# Altium schematic sheet PWR_MGMT.SchDoc
size A4; SheetNumber: 3; SheetTotal: 3
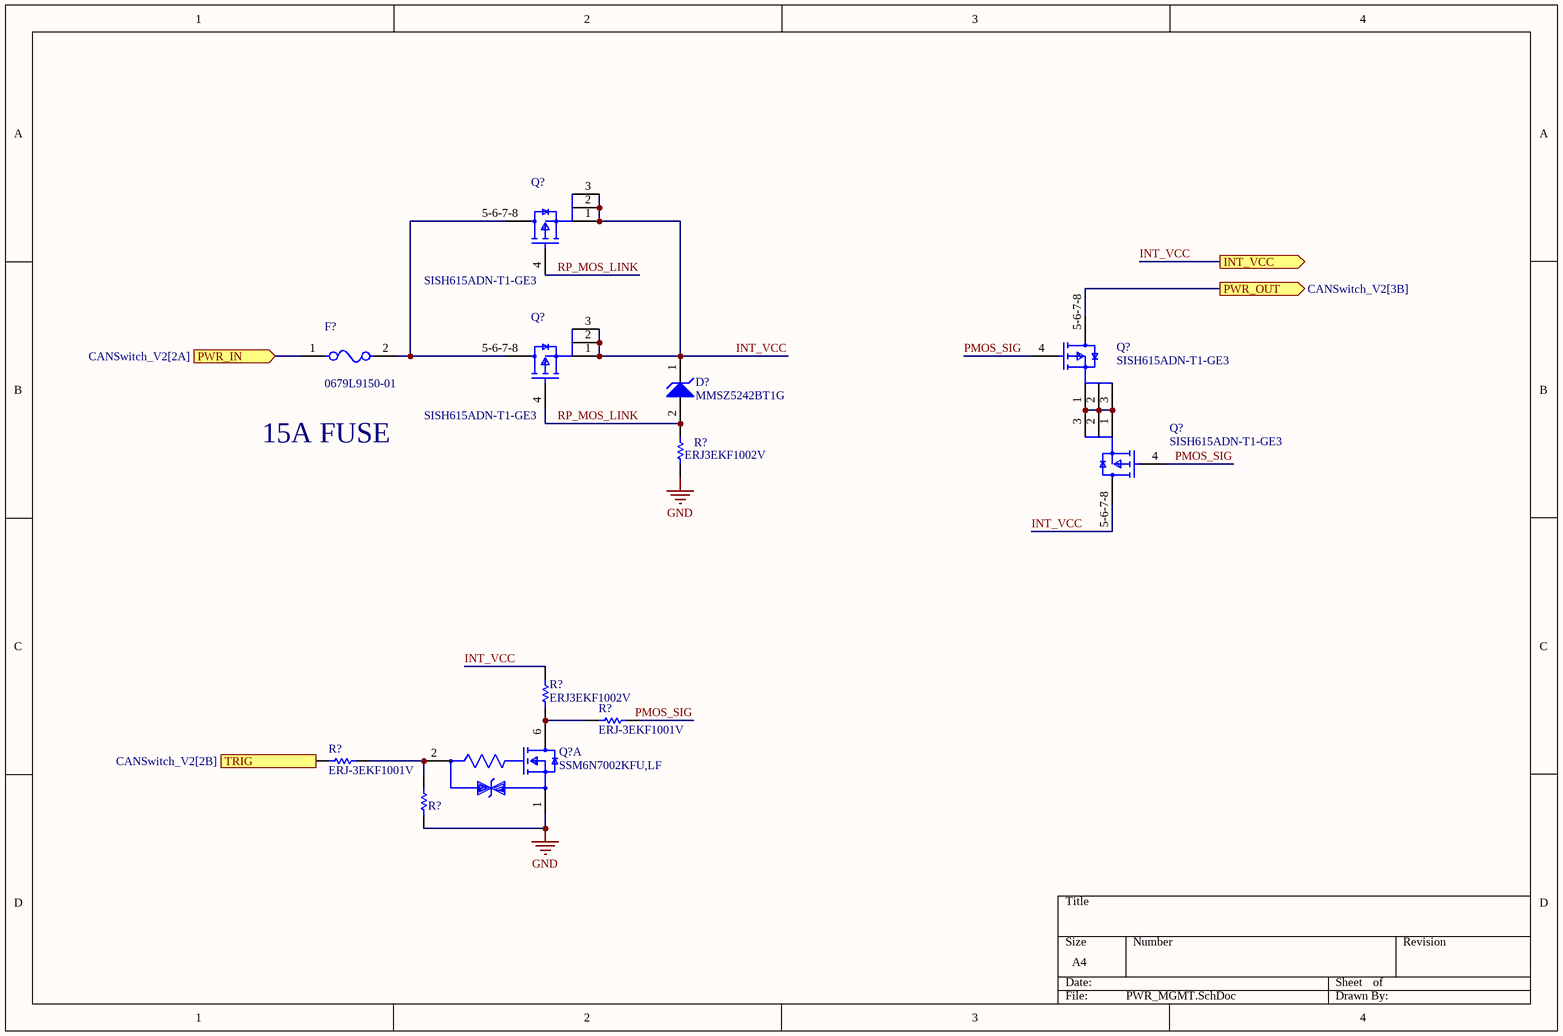
[diagram p0: PWR_MGMT.SchDoc]

## Parts
(Parts that share a designator on the sheet are numbered #1, #2 ... from top to bottom, then left to right.)
D?  MMSZ5242BT1G  [ONSC-SOD-123-2-425-04_V]
F?  0679L9150-01  [FP-0679L-MFG]
Q?#1  SISH615ADN-T1-GE3  [SISH615ADN-T1-GE3-Footprint-1]
Q?#2  SISH615ADN-T1-GE3  [SISH615ADN-T1-GE3-Footprint-1]
Q?#3  SISH615ADN-T1-GE3  [SISH615ADN-T1-GE3-Footprint-1]
Q?#4  SISH615ADN-T1-GE3  [SISH615ADN-T1-GE3-Footprint-1]
Q?#5  SSM6N7002KFU,LF  [FP-SSOP6-P-0_65A-MFG]  (part A of 2)
R?#1  ERJ3EKF1002V  [RESC1609X55X30LL15T15]
R?#2  ERJ3EKF1002V  [RESC1609X55X30LL15T15]
R?#3  ERJ-3EKF1001V  [RESC1608X55X30LL15T15]
R?#4  ERJ-3EKF1001V  [RESC1608X55X30LL15T15]
R?#5  ERJ3EKF1002V  [RESC1609X55X30LL15T15]  (value not drawn)

## Ports
INT_VCC (out), PWR_IN (in, see CANSwitch_V2[2A]), PWR_OUT (out, see CANSwitch_V2[3B]), TRIG (in, see CANSwitch_V2[2B])

## Nets
GND: Q?#5.1(Source1) R?#1.2 R?#5.2
INT_VCC: D?.1(K) Q?#1.1(S) Q?#1.2(S) Q?#1.3(S) Q?#3.1(S) Q?#3.2(S) Q?#3.3(S) Q?#4.5-6-7-8(D) R?#2.2 ; port INT_VCC
PMOS_SIG: Q?#2.4(G) Q?#4.4(G) R?#3.1
PWR_IN: F?.1 ; port PWR_IN
PWR_OUT: Q?#2.5-6-7-8(D) ; port PWR_OUT
RP_MOS_LINK: D?.2(A) Q?#1.4(G) Q?#3.4(G) R?#1.1
TRIG: R?#4.2 ; port TRIG
NetF?_2: F?.2 Q?#1.5-6-7-8(D) Q?#3.5-6-7-8(D)
NetQ?#2_1: Q?#2.1(S) Q?#2.2(S) Q?#2.3(S) Q?#4.1(S) Q?#4.2(S) Q?#4.3(S)
NetQ?#5_2: Q?#5.2(Gate1) R?#4.1 R?#5.1
NetQ?#5_6: Q?#5.6(Drain1) R?#2.1 R?#3.2

## Notes on the sheet
- 15A FUSE

## Library data of the parts
D? = CMP-1060-00565-1: Zener Voltage Regulator, 500 mW, 2-Pin SOD-123, Pb-Free, Tape and Reel; Manufacturer: On Semiconductor; P Max (W): 0.5; VZ Typ (V): 12; PartNumber: MMSZ5242BT1G; PackageReference: SOD-123-2-425-04; ComponentLink3URL: http://www.onsemi.com/pub_link/Collateral/425-04.PDF; Mounting Technology: Surface Mount; ComponentLink2Description: Datasheet; ComponentLink1URL: http://www.onsemi.com/; ComponentLink3Description: Package Specification; PackageDescription: 2-Pin SOD, Body 1.6 x 2.69 mm; PackageVersion: Rev. G, 10/2009; ComponentLink1Description: Manufacturer URL; RoHS: Pb-Free; ComponentLink2URL: http://www.onsemi.com/pub_link/Collateral/MMSZ5221BT1-D.PDF; Packing: Tape and Reel; DatasheetVersion: Rev. 12
F? = CMP-16042-000002-1: FUSE BRD MNT 15A 125VAC/VDC; Manufacturer: Bel Fuse; Max Fuse Ac Voltage: 125V; Fuse Blow Speed: Fast; Fuse I2T: 103.5A2Sec; Fuse Interrupt Ac Current: 50A; Automotive Grade: Grade 1; Value: 0.0038Ω; Fuse Interrupt Dc Current: 300A; Fuse Voltage Drop: 0.13V; Device Class L2: Fuses; ComponentLink2URL: https://www.belfuse.com/resources/CircuitProtection/datasheets/0679L%20Sep2016.pdf; Package: 0679L; Height: 2.79mm; Digikey Description: FUSE BRD MNT 15A 125VAC/VDC; Temperature Range High: +125°C; Device Class L3: unset; Octopart: https://octopart.com/0679l9150-01-bel+fuse-70850665; Temperature Range Low: -55°C; Fuse Current: 15A; Max Fuse Dc Voltage: 125V; Ipc Land Pattern Name: CAPC610254X254; Manufacturer Part Number: 0679L9150-01; Category: Fuse; Lead Free: Yes; Automotive: Yes; Resistance: 0.0038Ω; RoHS: TRUE; Device Class L1: Circuit Protection; ComponentLink2Description: Datasheet; Temperature: -55°C to +125°C; Voltage Rating: 125V
Q?#1 Q?#3 = CMP-013-00036-2: Trans MOSFET P-CH 20V 22.1A 8-Pin PowerPAK 1212 EP T/R
Q?#2 Q?#4 = CMP-013-00036-1: Trans MOSFET P-CH 20V 22.1A 8-Pin PowerPAK 1212 EP T/R
Q?#5 = CMP-35916-000009-1: MOSFET 2N-CH 60V 0.3A; Input Capacitance: 40pF; Continuous Drain Current (ID): 300mA; Max Power Dissipation: 285mW; FET Type: 2 N-Channel; Rds On Max: 1.5R; Mount: Surface Mount; Drain to Source Voltage (Vdss): 60V; Packaging: Tape and Reel
R?#1 R?#2 R?#5 = CMP-1012-00623-3: Chip Resistor, 10 KOhm, +/- 1%, 0.1 W, -55 to 155 degC, 0603 (1608 Metric), RoHS, Tape and Reel; Manufacturer: Panasonic; Voltage Rating: 75V; Case\/Package: 0603; Power Rating: 100mW; Resistance: 10KOhm; Temperature Coefficient: 100ppm\/degreesC; Number of Pins: 2; Package Reference: 603; Depth: 0.8mm; Mount: SurfaceMount; Package Description: 2-Pin Surface Mount Device, Body 1.6 x 0.85 mm; Datasheet Version: 02/2017; Length: 1.6mm; Lead Free: LeadFree; Height: 0.45mm; Number of Terminations: 2; Max Power Dissipation: 100mW; Min Operating Temperature: -55degC; Datasheet URL: https://industrial.panasonic.com/cdbs/www-data/pdf/RDA0000/AOA0000C304.pdf; Termination: SMD/SMT; Case Code (Metric): 1608; Case Code (Imperial): 0603; Tolerance: 1%; Max Operating Temperature: 155degC; RoHSCompliant: true; Voltage Rating (DC): 75V; Radiation Hardening: No; Packaging: TapeandReel; Composition: ThickFilm; Mounting Technology: SurfaceMount; Manufacturer URL: http://www.panasonic.com/; Width: 0.031inch; REACH SVHC: NoSVHC; Contact Plating: Tin; Military Standard: Not; Package Quantity: 1
R?#3 R?#4 = CMP-2000-00180-1: Manufacturer: Panasonic; Part Number: ERJ-3EKF1001V